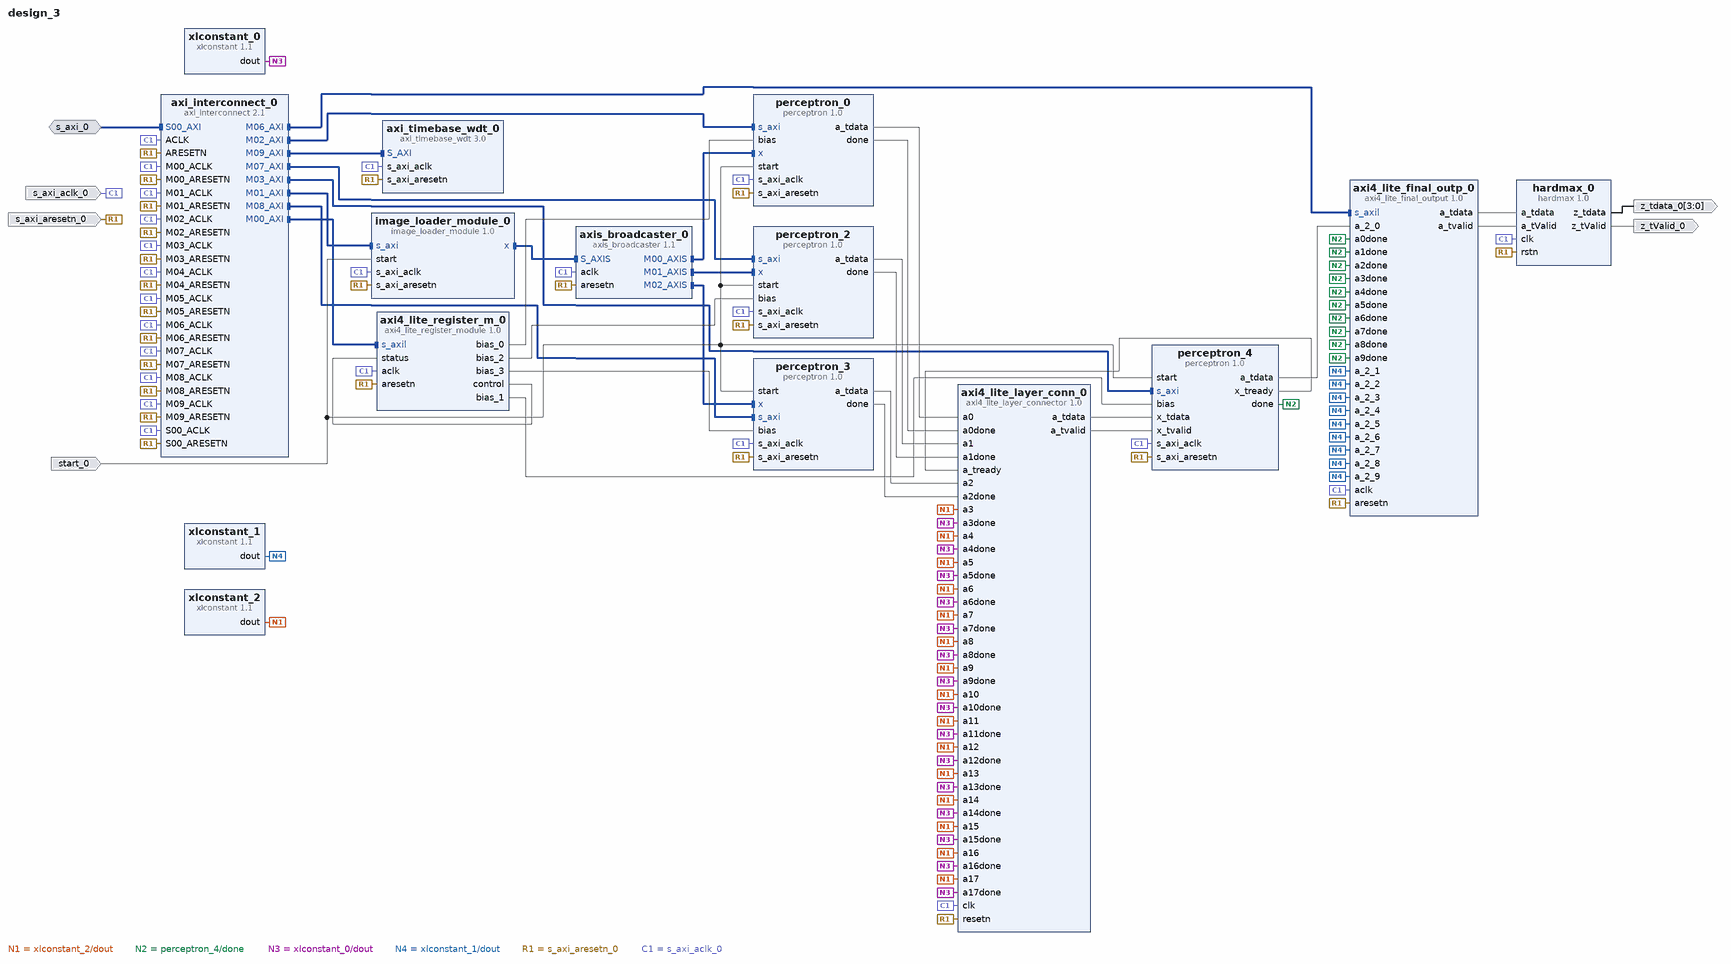
[diagram p0: block diagram of the top level]
# Vivado block design design_3, xc7z010clg400-1, Vivado 2019.2
create_bd_design design_3

create_bd_intf_port -mode Slave -vlnv xilinx.com:interface:aximm_rtl:1.0 s_axi_0
set_property -dict [list \
  CONFIG.DATA_WIDTH 32 \
  CONFIG.PROTOCOL AXI4LITE \
  CONFIG.ID_WIDTH 0 \
  CONFIG.ADDR_WIDTH 32 \
  CONFIG.AWUSER_WIDTH 0 \
  CONFIG.ARUSER_WIDTH 0 \
  CONFIG.WUSER_WIDTH 0 \
  CONFIG.RUSER_WIDTH 0 \
  CONFIG.BUSER_WIDTH 0 \
  CONFIG.READ_WRITE_MODE READ_WRITE \
  CONFIG.HAS_BURST 1 \
  CONFIG.HAS_LOCK 1 \
  CONFIG.HAS_PROT 1 \
  CONFIG.HAS_CACHE 1 \
  CONFIG.HAS_QOS 1 \
  CONFIG.HAS_REGION 0 \
  CONFIG.HAS_WSTRB 1 \
  CONFIG.HAS_BRESP 1 \
  CONFIG.HAS_RRESP 1 \
  CONFIG.SUPPORTS_NARROW_BURST 0 \
  CONFIG.NUM_READ_OUTSTANDING 2 \
  CONFIG.NUM_WRITE_OUTSTANDING 2 \
  CONFIG.MAX_BURST_LENGTH 1 \
  CONFIG.NUM_READ_THREADS 1 \
  CONFIG.NUM_WRITE_THREADS 1 \
  CONFIG.RUSER_BITS_PER_BYTE 0 \
  CONFIG.WUSER_BITS_PER_BYTE 0 \
] [get_bd_intf_ports s_axi_0]
create_bd_port -dir I start_0
create_bd_port -dir I -type rst s_axi_aresetn_0
create_bd_port -dir I -type clk s_axi_aclk_0
create_bd_port -dir O -from 3 -to 0 z_tdata_0
create_bd_port -dir O z_tValid_0

create_bd_cell -type ip -vlnv xilinx.com:user:axi4_lite_register_module:1.0 axi4_lite_register_m_0
create_bd_cell -type ip -vlnv xilinx.com:ip:axi_interconnect:2.1 axi_interconnect_0
set_property -dict {CONFIG.NUM_MI 10} [get_bd_cells axi_interconnect_0]
create_bd_cell -type ip -vlnv xilinx.com:ip:axi_timebase_wdt:3.0 axi_timebase_wdt_0
create_bd_cell -type ip -vlnv xilinx.com:ip:axis_broadcaster:1.1 axis_broadcaster_0
set_property -dict {CONFIG.M02_TDATA_REMAP {tdata[31:0]} CONFIG.NUM_MI 3} [get_bd_cells axis_broadcaster_0]
create_bd_cell -type ip -vlnv xilinx.com:user:image_loader_module:1.0 image_loader_module_0
create_bd_cell -type ip -vlnv xilinx.com:ip:xlconstant:1.1 xlconstant_0
create_bd_cell -type ip -vlnv xilinx.com:ip:xlconstant:1.1 xlconstant_1
set_property -dict {CONFIG.CONST_VAL 0 CONFIG.CONST_WIDTH 32} [get_bd_cells xlconstant_1]
create_bd_cell -type ip -vlnv xilinx.com:ip:xlconstant:1.1 xlconstant_2
set_property -dict {CONFIG.CONST_VAL 0 CONFIG.CONST_WIDTH 32} [get_bd_cells xlconstant_2]
create_bd_cell -type ip -vlnv xilinx.com:user:axi4_lite_layer_connector:1.0 axi4_lite_layer_conn_0
create_bd_cell -type ip -vlnv xilinx.com:user:axi4_lite_final_output:1.0 axi4_lite_final_outp_0
create_bd_cell -type ip -vlnv xilinx.com:user:hardmax:1.0 hardmax_0
create_bd_cell -type ip -vlnv xilinx.com:user:perceptron:1.0 perceptron_0
create_bd_cell -type ip -vlnv xilinx.com:user:perceptron:1.0 perceptron_2
create_bd_cell -type ip -vlnv xilinx.com:user:perceptron:1.0 perceptron_3
create_bd_cell -type ip -vlnv xilinx.com:user:perceptron:1.0 perceptron_4
set_property -dict {CONFIG.input_size 18} [get_bd_cells perceptron_4]

# ---- connections ----

connect_bd_intf_net [get_bd_intf_pins image_loader_module_0/x] [get_bd_intf_pins axis_broadcaster_0/S_AXIS]
connect_bd_intf_net [get_bd_intf_pins axis_broadcaster_0/M00_AXIS] [get_bd_intf_pins perceptron_0/x]
connect_bd_intf_net [get_bd_intf_pins axi_timebase_wdt_0/S_AXI] [get_bd_intf_pins axi_interconnect_0/M09_AXI]
connect_bd_intf_net [get_bd_intf_pins axi_interconnect_0/M06_AXI] [get_bd_intf_pins axi4_lite_final_outp_0/s_axil]
connect_bd_intf_net [get_bd_intf_pins axi_interconnect_0/M08_AXI] [get_bd_intf_pins perceptron_3/s_axi]
connect_bd_intf_net [get_bd_intf_pins axi_interconnect_0/M01_AXI] [get_bd_intf_pins image_loader_module_0/s_axi]
connect_bd_intf_net [get_bd_intf_pins axis_broadcaster_0/M01_AXIS] [get_bd_intf_pins perceptron_2/x]
connect_bd_intf_net -intf_net S00_AXI_0_1 [get_bd_intf_ports s_axi_0] [get_bd_intf_pins axi_interconnect_0/S00_AXI]
connect_bd_intf_net [get_bd_intf_pins axi_interconnect_0/M02_AXI] [get_bd_intf_pins perceptron_0/s_axi]
connect_bd_intf_net [get_bd_intf_pins axi_interconnect_0/M07_AXI] [get_bd_intf_pins perceptron_2/s_axi]
connect_bd_intf_net [get_bd_intf_pins axis_broadcaster_0/M02_AXIS] [get_bd_intf_pins perceptron_3/x]
connect_bd_intf_net [get_bd_intf_pins axi_interconnect_0/M00_AXI] [get_bd_intf_pins axi4_lite_register_m_0/s_axil]
connect_bd_intf_net [get_bd_intf_pins axi_interconnect_0/M03_AXI] [get_bd_intf_pins perceptron_4/s_axi]
connect_bd_net [get_bd_pins axi4_lite_final_outp_0/a_tdata] [get_bd_pins hardmax_0/a_tdata]
connect_bd_net [get_bd_pins axi4_lite_final_outp_0/a_tvalid] [get_bd_pins hardmax_0/a_tValid]
connect_bd_net [get_bd_pins axi4_lite_layer_conn_0/a_tdata] [get_bd_pins perceptron_4/x_tdata]
connect_bd_net [get_bd_pins axi4_lite_layer_conn_0/a_tvalid] [get_bd_pins perceptron_4/x_tvalid]
connect_bd_net [get_bd_pins axi4_lite_register_m_0/bias_0] [get_bd_pins perceptron_0/bias]
connect_bd_net [get_bd_pins axi4_lite_register_m_0/bias_1] [get_bd_pins perceptron_4/bias]
connect_bd_net -net axi4_lite_register_m_0_bias_2 [get_bd_pins xlconstant_2/dout] \
  [get_bd_pins axi4_lite_layer_conn_0/a3] [get_bd_pins axi4_lite_layer_conn_0/a4] [get_bd_pins axi4_lite_layer_conn_0/a5] \
  [get_bd_pins axi4_lite_layer_conn_0/a6] [get_bd_pins axi4_lite_layer_conn_0/a7] [get_bd_pins axi4_lite_layer_conn_0/a8] \
  [get_bd_pins axi4_lite_layer_conn_0/a9] [get_bd_pins axi4_lite_layer_conn_0/a10] [get_bd_pins axi4_lite_layer_conn_0/a11] \
  [get_bd_pins axi4_lite_layer_conn_0/a12] [get_bd_pins axi4_lite_layer_conn_0/a13] [get_bd_pins axi4_lite_layer_conn_0/a14] \
  [get_bd_pins axi4_lite_layer_conn_0/a15] [get_bd_pins axi4_lite_layer_conn_0/a16] [get_bd_pins axi4_lite_layer_conn_0/a17]
connect_bd_net [get_bd_pins axi4_lite_register_m_0/bias_2] [get_bd_pins perceptron_2/bias]
connect_bd_net [get_bd_pins axi4_lite_register_m_0/bias_3] [get_bd_pins perceptron_3/bias]
connect_bd_net [get_bd_pins axi4_lite_register_m_0/control] [get_bd_pins axi4_lite_register_m_0/status]
connect_bd_net [get_bd_pins perceptron_0/a_tdata] [get_bd_pins axi4_lite_layer_conn_0/a0]
connect_bd_net [get_bd_pins perceptron_0/done] [get_bd_pins axi4_lite_layer_conn_0/a0done]
connect_bd_net -net perceptron_1_done [get_bd_pins perceptron_4/done] \
  [get_bd_pins axi4_lite_final_outp_0/a0done] [get_bd_pins axi4_lite_final_outp_0/a1done] \
  [get_bd_pins axi4_lite_final_outp_0/a2done] [get_bd_pins axi4_lite_final_outp_0/a3done] \
  [get_bd_pins axi4_lite_final_outp_0/a4done] [get_bd_pins axi4_lite_final_outp_0/a5done] \
  [get_bd_pins axi4_lite_final_outp_0/a6done] [get_bd_pins axi4_lite_final_outp_0/a7done] \
  [get_bd_pins axi4_lite_final_outp_0/a8done] [get_bd_pins axi4_lite_final_outp_0/a9done]
connect_bd_net [get_bd_pins perceptron_2/a_tdata] [get_bd_pins axi4_lite_layer_conn_0/a1]
connect_bd_net [get_bd_pins perceptron_2/done] [get_bd_pins axi4_lite_layer_conn_0/a1done]
connect_bd_net [get_bd_pins perceptron_3/a_tdata] [get_bd_pins axi4_lite_layer_conn_0/a2]
connect_bd_net [get_bd_pins perceptron_3/done] [get_bd_pins axi4_lite_layer_conn_0/a2done]
connect_bd_net [get_bd_pins xlconstant_0/dout] \
  [get_bd_pins axi4_lite_layer_conn_0/a3done] [get_bd_pins axi4_lite_layer_conn_0/a4done] \
  [get_bd_pins axi4_lite_layer_conn_0/a5done] [get_bd_pins axi4_lite_layer_conn_0/a6done] \
  [get_bd_pins axi4_lite_layer_conn_0/a7done] [get_bd_pins axi4_lite_layer_conn_0/a8done] \
  [get_bd_pins axi4_lite_layer_conn_0/a9done] [get_bd_pins axi4_lite_layer_conn_0/a10done] \
  [get_bd_pins axi4_lite_layer_conn_0/a11done] [get_bd_pins axi4_lite_layer_conn_0/a12done] \
  [get_bd_pins axi4_lite_layer_conn_0/a13done] [get_bd_pins axi4_lite_layer_conn_0/a14done] \
  [get_bd_pins axi4_lite_layer_conn_0/a15done] [get_bd_pins axi4_lite_layer_conn_0/a16done] \
  [get_bd_pins axi4_lite_layer_conn_0/a17done]
connect_bd_net [get_bd_pins xlconstant_1/dout] \
  [get_bd_pins axi4_lite_final_outp_0/a_2_1] [get_bd_pins axi4_lite_final_outp_0/a_2_2] \
  [get_bd_pins axi4_lite_final_outp_0/a_2_3] [get_bd_pins axi4_lite_final_outp_0/a_2_4] \
  [get_bd_pins axi4_lite_final_outp_0/a_2_5] [get_bd_pins axi4_lite_final_outp_0/a_2_6] \
  [get_bd_pins axi4_lite_final_outp_0/a_2_7] [get_bd_pins axi4_lite_final_outp_0/a_2_8] \
  [get_bd_pins axi4_lite_final_outp_0/a_2_9]
connect_bd_net -net start_0_1 [get_bd_ports start_0] \
  [get_bd_pins image_loader_module_0/start] [get_bd_pins perceptron_0/start] [get_bd_pins perceptron_2/start] \
  [get_bd_pins perceptron_3/start] [get_bd_pins perceptron_4/start]
connect_bd_net -net s_axi_aresetn_0_1 [get_bd_ports s_axi_aresetn_0] \
  [get_bd_pins axi_interconnect_0/S00_ARESETN] [get_bd_pins axi4_lite_register_m_0/aresetn] \
  [get_bd_pins axi_interconnect_0/M00_ARESETN] [get_bd_pins axi_interconnect_0/ARESETN] \
  [get_bd_pins axi_interconnect_0/M01_ARESETN] [get_bd_pins axi_interconnect_0/M02_ARESETN] \
  [get_bd_pins axi_interconnect_0/M03_ARESETN] [get_bd_pins axi_interconnect_0/M04_ARESETN] \
  [get_bd_pins axi_interconnect_0/M05_ARESETN] [get_bd_pins image_loader_module_0/s_axi_aresetn] \
  [get_bd_pins axi_interconnect_0/M06_ARESETN] [get_bd_pins axi_timebase_wdt_0/s_axi_aresetn] \
  [get_bd_pins axis_broadcaster_0/aresetn] [get_bd_pins axi_interconnect_0/M07_ARESETN] \
  [get_bd_pins axi_interconnect_0/M08_ARESETN] [get_bd_pins axi_interconnect_0/M09_ARESETN] \
  [get_bd_pins axi4_lite_layer_conn_0/resetn] [get_bd_pins axi4_lite_final_outp_0/aresetn] [get_bd_pins hardmax_0/rstn] \
  [get_bd_pins perceptron_0/s_axi_aresetn] [get_bd_pins perceptron_2/s_axi_aresetn] [get_bd_pins perceptron_3/s_axi_aresetn] \
  [get_bd_pins perceptron_4/s_axi_aresetn]
connect_bd_net -net s_axi_aclk_0_1 [get_bd_ports s_axi_aclk_0] \
  [get_bd_pins axi_interconnect_0/S00_ACLK] [get_bd_pins axi4_lite_register_m_0/aclk] \
  [get_bd_pins axi_interconnect_0/M00_ACLK] [get_bd_pins axi_interconnect_0/ACLK] [get_bd_pins axi_interconnect_0/M01_ACLK] \
  [get_bd_pins axi_interconnect_0/M02_ACLK] [get_bd_pins axi_interconnect_0/M03_ACLK] \
  [get_bd_pins axi_interconnect_0/M04_ACLK] [get_bd_pins axi_interconnect_0/M05_ACLK] \
  [get_bd_pins image_loader_module_0/s_axi_aclk] [get_bd_pins axi_interconnect_0/M06_ACLK] \
  [get_bd_pins axi_timebase_wdt_0/s_axi_aclk] [get_bd_pins axis_broadcaster_0/aclk] [get_bd_pins axi_interconnect_0/M07_ACLK] \
  [get_bd_pins axi_interconnect_0/M08_ACLK] [get_bd_pins axi_interconnect_0/M09_ACLK] \
  [get_bd_pins axi4_lite_layer_conn_0/clk] [get_bd_pins axi4_lite_final_outp_0/aclk] [get_bd_pins hardmax_0/clk] \
  [get_bd_pins perceptron_0/s_axi_aclk] [get_bd_pins perceptron_2/s_axi_aclk] [get_bd_pins perceptron_3/s_axi_aclk] \
  [get_bd_pins perceptron_4/s_axi_aclk]
connect_bd_net [get_bd_pins hardmax_0/z_tdata] [get_bd_ports z_tdata_0]
connect_bd_net [get_bd_pins hardmax_0/z_tValid] [get_bd_ports z_tValid_0]
connect_bd_net [get_bd_pins perceptron_4/x_tready] [get_bd_pins axi4_lite_layer_conn_0/a_tready]
connect_bd_net [get_bd_pins perceptron_4/a_tdata] [get_bd_pins axi4_lite_final_outp_0/a_2_0]

# ---- address map ----
assign_bd_address -offset 0x41A00000 -range 64K -target_address_space [get_bd_addr_spaces s_axi_0] [get_bd_addr_segs axi_timebase_wdt_0/S_AXI/Reg]
assign_bd_address -offset 0x44A00000 -range 64K -target_address_space [get_bd_addr_spaces s_axi_0] [get_bd_addr_segs axi4_lite_final_outp_0/s_axil/reg0]
assign_bd_address -offset 0x44A10000 -range 64K -target_address_space [get_bd_addr_spaces s_axi_0] [get_bd_addr_segs image_loader_module_0/s_axi/reg0]
assign_bd_address -offset 0x44A20000 -range 64K -target_address_space [get_bd_addr_spaces s_axi_0] [get_bd_addr_segs perceptron_0/s_axi/reg0]
assign_bd_address -offset 0x44A30000 -range 64K -target_address_space [get_bd_addr_spaces s_axi_0] [get_bd_addr_segs perceptron_4/s_axi/reg0]
assign_bd_address -offset 0x44A40000 -range 64K -target_address_space [get_bd_addr_spaces s_axi_0] [get_bd_addr_segs perceptron_2/s_axi/reg0]
assign_bd_address -offset 0x44A50000 -range 64K -target_address_space [get_bd_addr_spaces s_axi_0] [get_bd_addr_segs perceptron_3/s_axi/reg0]
assign_bd_address -offset 0x80000000 -range 2G -target_address_space [get_bd_addr_spaces s_axi_0] [get_bd_addr_segs axi4_lite_register_m_0/s_axil/reg0]

validate_bd_design
save_bd_design
